# Altium schematic sheet 中频V01.SchDoc
size A3
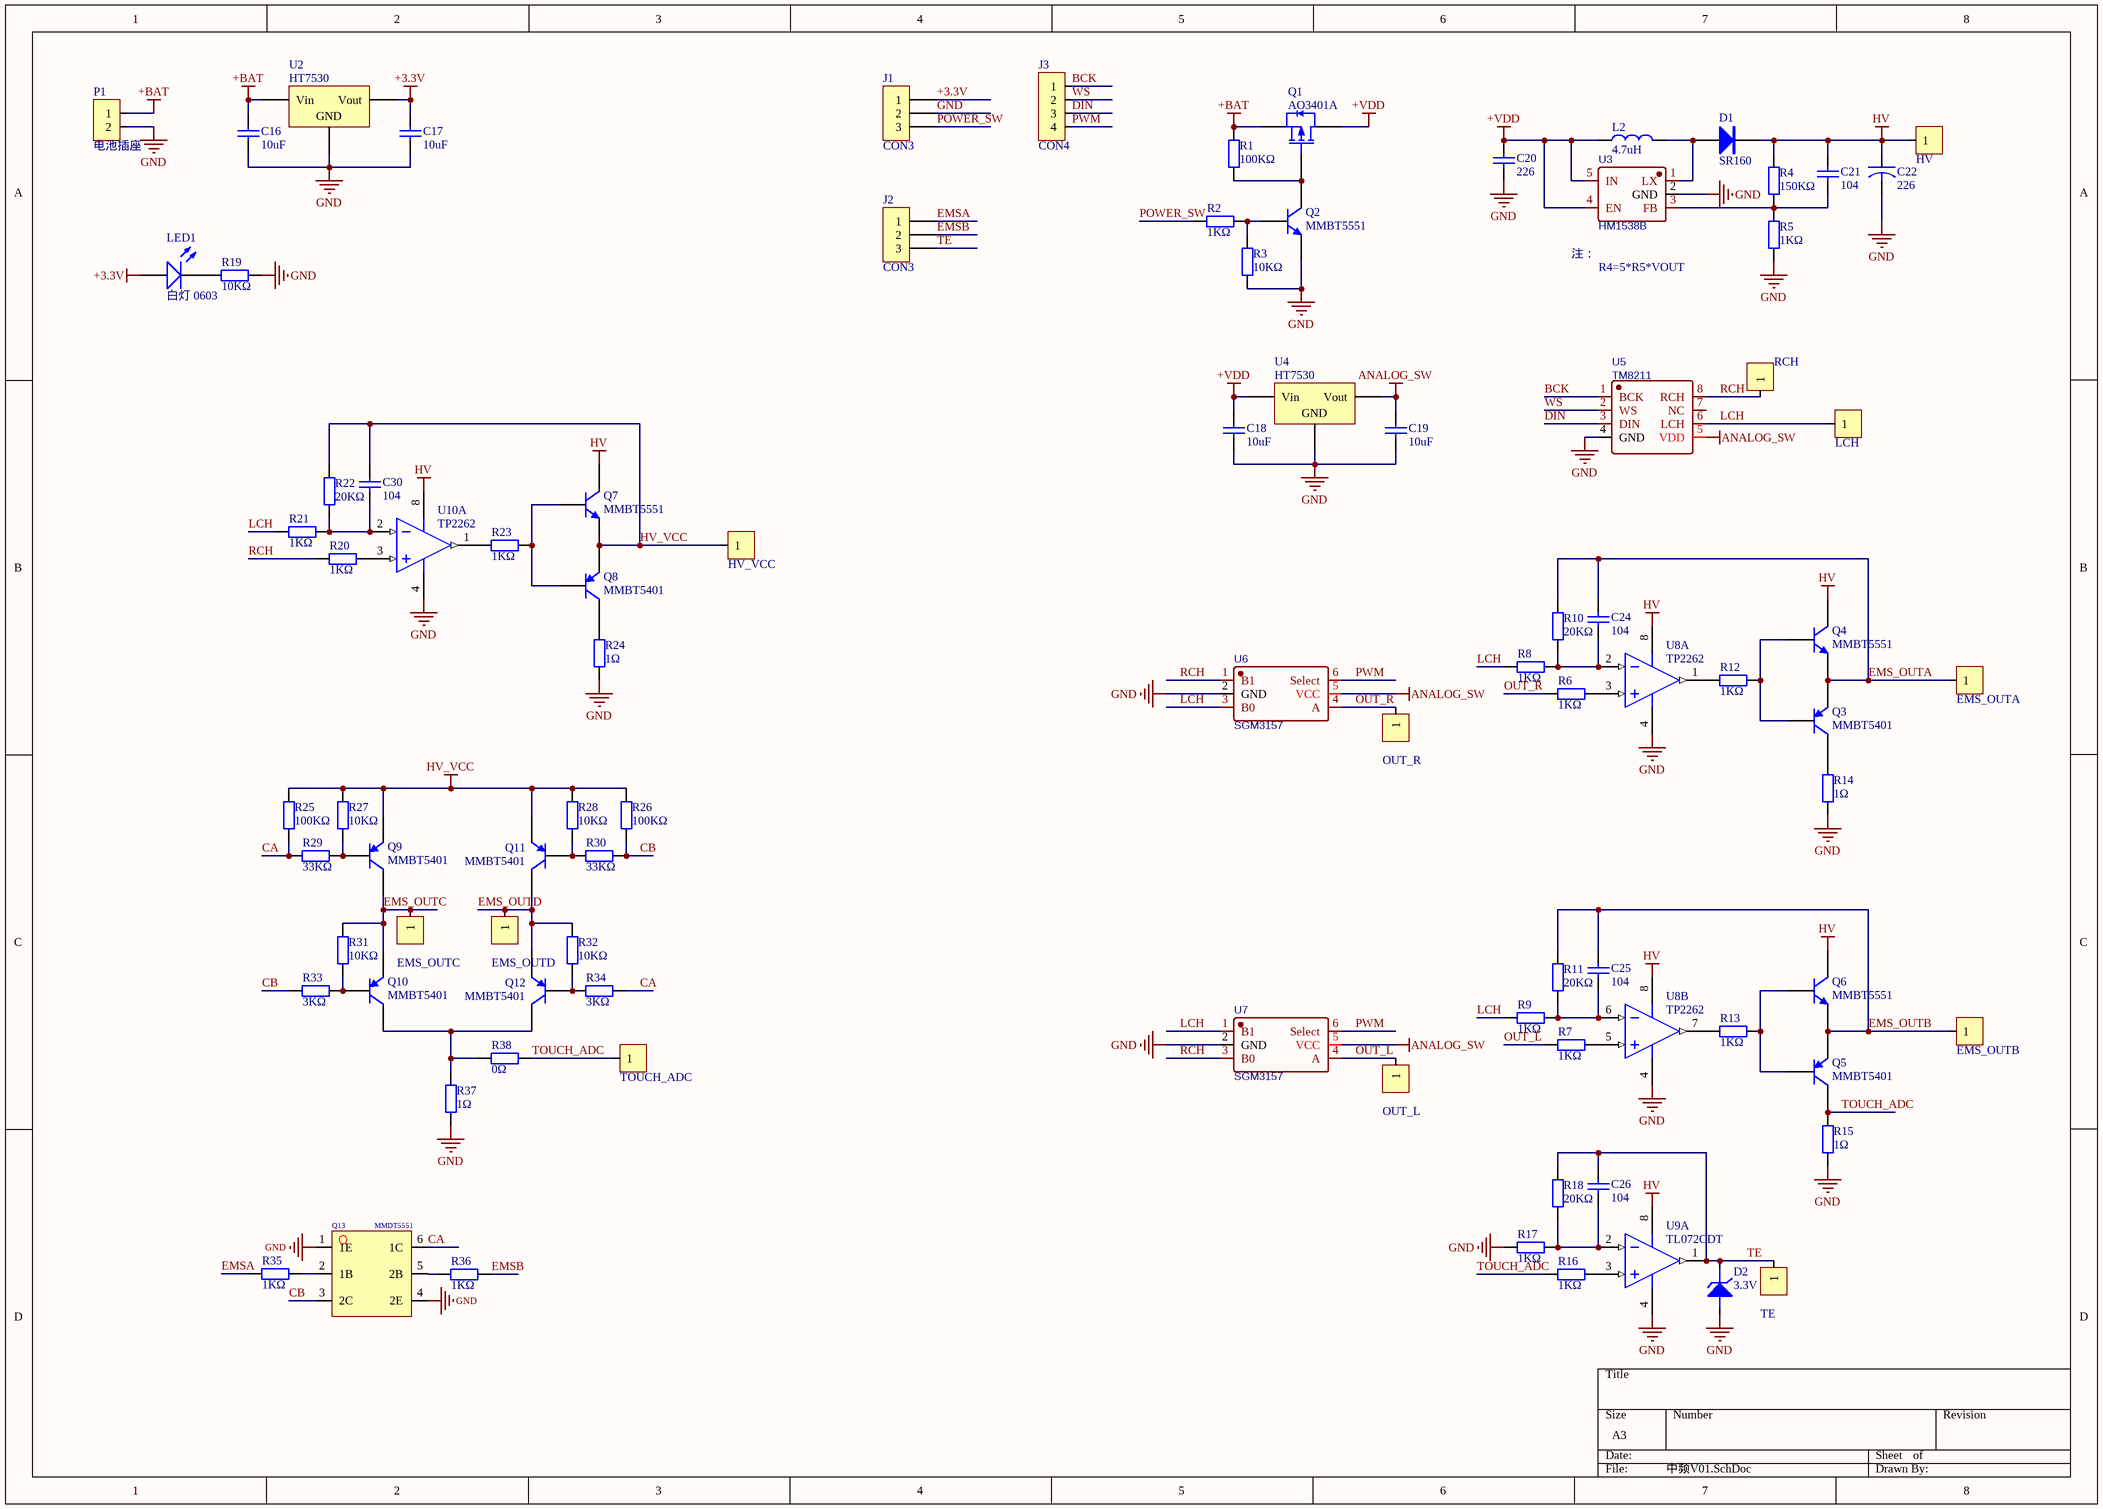
[diagram p0: 中频V01.SchDoc]

## Parts
C16  10uF  [0603_C]
C17  10uF  [0603_C]
C18  10uF  [0603_C]
C19  10uF  [0603_C]
C20  226  [0603_C]
C21  104  [0603_C]
C22  226  [1206_C]
C24  104  [0603_C]
C25  104  [0603_C]
C26  104  [0603_C]
C30  104  [0603_C]
D1  SR160  [SOD-123]
D2  3.3V  [SOD-323]
EMS_OUTA  CON1  [PAD-1P]  (value not drawn)
EMS_OUTB  CON1  [PAD-1P]  (value not drawn)
EMS_OUTC  CON1  [PAD-1P]  (value not drawn)
EMS_OUTD  CON1  [PAD-1P]  (value not drawn)
HV  CON1  [PAD-1P]  (value not drawn)
HV_VCC  CON1  [PAD-1P]  (value not drawn)
J1  CON3  [HDR-TH_3P-P2.54-V]
J2  CON3  [HDR-TH_3P-P2.54-V]
J3  CON4  [HDR-TH_4P-P2.54-V]
L2  4.7uH  [CD43]
LCH  CON1  [PAD-1P]  (value not drawn)
LED1  白灯 0603  [0603_LED_S1]
OUT_L  CON1  [PAD-1P]  (value not drawn)
OUT_R  CON1  [PAD-1P]  (value not drawn)
P1  电池插座  [1.25-2PIN]
Q1  AO3401A  [SOT-23-3L]
Q2  MMBT5551  [SOT-23(SOT-23-3)]
Q3  MMBT5401  [SOT-23(SOT-23-3)]
Q4  MMBT5551  [SOT-23(SOT-23-3)]
Q5  MMBT5401  [SOT-23(SOT-23-3)]
Q6  MMBT5551  [SOT-23(SOT-23-3)]
Q7  MMBT5551  [SOT-23(SOT-23-3)]
Q8  MMBT5401  [SOT-23(SOT-23-3)]
Q9  MMBT5401  [SOT-23(SOT-23-3)]
Q10  MMBT5401  [SOT-23(SOT-23-3)]
Q11  MMBT5401  [SOT-23(SOT-23-3)]
Q12  MMBT5401  [SOT-23(SOT-23-3)]
Q13  MMDT5551  [SOT-363]
R1  100KΩ  [0603_R]
R2  1KΩ  [0603_R]
R3  10KΩ  [0603_R]
R4  150KΩ  [0603_R]
R5  1KΩ  [0603_R]
R6  1KΩ  [0603_R]
R7  1KΩ  [0603_R]
R8  1KΩ  [0603_R]
R9  1KΩ  [0603_R]
R10  20KΩ  [0603_R]
R11  20KΩ  [0603_R]
R12  1KΩ  [0603_R]
R13  1KΩ  [0603_R]
R14  1Ω  [0603_R]
R15  1Ω  [0603_R]
R16  1KΩ  [0603_R]
R17  1KΩ  [0603_R]
R18  20KΩ  [0603_R]
R19  10KΩ  [0603_R]
R20  1KΩ  [0603_R]
R21  1KΩ  [0603_R]
R22  20KΩ  [0603_R]
R23  1KΩ  [0603_R]
R24  1Ω  [0603_R]
R25  100KΩ  [0603_R]
R26  100KΩ  [0603_R]
R27  10KΩ  [0603_R]
R28  10KΩ  [0603_R]
R29  33KΩ  [0603_R]
R30  33KΩ  [0603_R]
R31  10KΩ  [0603_R]
R32  10KΩ  [0603_R]
R33  3KΩ  [0603_R]
R34  3KΩ  [0603_R]
R35  1KΩ  [0603_R]
R36  1KΩ  [0603_R]
R37  1Ω  [0603_R]
R38  0Ω  [0603_R]
RCH  CON1  [PAD-1P]  (value not drawn)
TE  CON1  [PAD-1P]  (value not drawn)
TOUCH_ADC  CON1  [PAD-1P]  (value not drawn)
U2  HT7530  [SOT-89(SOT-89-3)]
U3  HM1538B  [HM1538B]
U4  HT7530  [SOT-89(SOT-89-3)]
U5  TM8211  [SOP-8_150MIL]
U6  SGM3157  [SC-70-6_L2.2-W1.3-P0.65-LS2.2-BL]
U7  SGM3157  [SC-70-6_L2.2-W1.3-P0.65-LS2.2-BL]
U8  TP2262  [SOIC-8_150mil]  (parts A,B of 2)
U9  TL072CDT  [SOIC-8_150mil]  (part A of 2)
U10  TP2262  [SOIC-8_150mil]  (part A of 2)

## Nets
+3.3V: C17.2 J1.1 LED1.A U2.3(Vout)
+BAT: C16.2 P1.1 Q1.2(S) R1.2 U2.2(Vin)
+VDD: C18.2 C20.2 L2.2 Q1.3(D) U3.4(EN) U3.5(IN) U4.2(Vin)
ANALOG_SW: C19.2 U4.3(Vout) U5.5(VDD) U6.5(VCC) U7.5(VCC)
GND: C16.1 C17.1 C18.1 C19.1 C20.1 C22.2 D2.1(A) J1.2 P1.2 Q2.2(E) Q13.1(1E) Q13.4(2E) R3.2 R5.2 R14.2 R15.2 R17.1 R19.1 R24.2 R37.2 U2.1(GND) U3.2(GND) U4.1(GND) U5.4(GND) U6.2(GND) U7.2(GND) U8.4(V-) U9.4(V-) U10.4(V-)
HV: C21.2 C22.1 D1.2 HV.1 Q4.3(C) Q6.3(C) Q7.3(C) R4.1 U8.8(V+) U9.8(V+) U10.8(V+)
HV_VCC: C30.2 HV_VCC.1 Q7.2(E) Q8.2(E) Q9.2(E) Q11.2(E) R22.2 R25.2 R26.2 R27.2 R28.2
BCK: J3.1 U5.1(BCK)
CA: Q13.6(1C) R25.1 R29.1 R34.2
CB: Q13.3(2C) R26.1 R30.2 R33.1
DIN: J3.3 U5.3(DIN)
EMS_OUTA: C24.2 EMS_OUTA.1 Q3.2(E) Q4.2(E) R10.2
EMS_OUTB: C25.2 EMS_OUTB.1 Q5.2(E) Q6.2(E) R11.1
EMS_OUTC: EMS_OUTC.1 Q9.3(C) Q10.2(E) R31.2
EMS_OUTD: EMS_OUTD.1 Q11.3(C) Q12.2(E) R32.2
EMSA: J2.1 R35.1
EMSB: J2.2 R36.2
LCH: LCH.1 R8.1 R9.1 R21.1 U5.6(LCH) U6.3(B0) U7.1(B1)
OUT_L: OUT_L.1 R7.1 U7.4(A)
OUT_R: OUT_R.1 R6.1 U6.4(A)
POWER_SW: J1.3 R2.2
PWM: J3.4 U6.6(Select) U7.6(Select)
RCH: R20.1 RCH.1 U5.8(RCH) U6.1(B1) U7.3(B0)
TE: C26.2 D2.2(K) J2.3 R18.2 TE.1 U9.1(OUT)
TOUCH_ADC: Q5.3(C) R15.1 R16.1 R38.2 TOUCH_ADC.1
WS: J3.2 U5.2(WS)
NetC21_1: C21.1 R4.2 R5.1 U3.3(FB)
NetC24_1: C24.1 R8.2 R10.1 U8.2(IN-)
NetC25_1: C25.1 R9.2 R11.2 U8.6(IN-)
NetC26_1: C26.1 R17.2 R18.1 U9.2(IN-)
NetC30_1: C30.1 R21.2 R22.1 U10.2(IN-)
NetD1_1: D1.1 L2.1 U3.1(LX)
NetLED1_K: LED1.K R19.2
NetQ1_1: Q1.1(G) Q2.3(C) R1.1
NetQ2_1: Q2.1(B) R2.1 R3.1
NetQ3_1: Q3.1(B) Q4.1(B) R12.2
NetQ3_3: Q3.3(C) R14.1
NetQ5_1: Q5.1(B) Q6.1(B) R13.2
NetQ7_1: Q7.1(B) Q8.1(B) R23.2
NetQ8_3: Q8.3(C) R24.1
NetQ9_1: Q9.1(B) R27.1 R29.2
NetQ10_1: Q10.1(B) R31.1 R33.2
NetQ10_3: Q10.3(C) Q12.3(C) R37.1 R38.1
NetQ11_1: Q11.1(B) R28.1 R30.1
NetQ12_1: Q12.1(B) R32.1 R34.1
NetQ13_2: Q13.2(1B) R35.2
NetQ13_5: Q13.5(2B) R36.1
NetR6_2: R6.2 U8.3(IN+)
NetR7_2: R7.2 U8.5(IN+)
NetR12_1: R12.1 U8.1(OUT)
NetR13_1: R13.1 U8.7(OUT)
NetR16_2: R16.2 U9.3(IN+)
NetR20_2: R20.2 U10.3(IN+)
NetR23_1: R23.1 U10.1(OUT)

Not connected (* = marked no-connect by the designer): U5 7(NC)

## Notes on the sheet
- (near U3) 注：
- R4=5*R5*VOUT

## Library data of the parts
C16-C19 C24-C26 C30 = 0603 1.2nF (122) 10% 50V: 贴片电容; ComponentLink1Description: 供应商链接; ComponentLink1URL: http://www.szlcsc.com/product/details_31372.html; Package: 0603; Supplier: LC; SuppliersPartNumber: C30615
C20 C21 = 0603 1uF (105) 10% 50V: 贴片电容; ComponentLink1Description: 供应商链接; ComponentLink1URL: http://www.szlcsc.com/product/details_16531.html; Package: 0603; Supplier: LC; SuppliersPartNumber: C15849
C22 = CAPACITOR
D1 = DO
D2 = ZENER3: Zener Diode
EMS_OUTA EMS_OUTB EMS_OUTC EMS_OUTD HV HV_VCC LCH OUT_L OUT_R RCH TE TOUCH_ADC = CON1: Connector
J1 J2 = CON3: Connector
J3 = CON4: Connector
L2 = INDUCTOR
LED1 = 0603 白灯: 发光二极管; ComponentLink1Description: 供应商链接; ComponentLink1URL: http://www.szlcsc.com/product/details_2663.html; Package: 0603; Supplier: LC; SuppliersPartNumber: C2290
P1 = CON2: Connector
Q1 = AO3401A P道沟 X13A15 SOT-23: MOS(场效应管); ComponentLink1Description: 供应商链接; ComponentLink1URL: http://www.szlcsc.com/product/details_15801.html; Package: SOT-23; Supplier: LC; SuppliersPartNumber: C15127
Q2 Q4 Q6 Q7 = SOT-23 MMBT5551  G1: 三极管; ComponentLink1Description: 供应商链接; ComponentLink1URL: http://www.szlcsc.com/product/details_2502.html; Package: SOT-23; Supplier: LC; SuppliersPartNumber: C2145
Q3 Q5 Q8-Q12 = SOT-23 MMBT5401 2L: 三极管; ComponentLink1Description: 供应商链接; ComponentLink1URL: http://www.szlcsc.com/product/details_8818.html; Package: SOT-23; Supplier: LC; SuppliersPartNumber: C8326
R1-R38 = 0603 1.2KΩ (1201) 1%: 贴片电阻; ComponentLink1Description: 供应商链接; ComponentLink1URL: http://www.szlcsc.com/product/details_23492.html; Package: 0603; Supplier: LC; SuppliersPartNumber: C22765
U2 U4 = SOT-89 HT7533-1: 低压差线性稳压(LDO); ComponentLink1Description: 供应商链接; ComponentLink1URL: http://www.szlcsc.com/product/details_14949.html; Package: SOT-89; Supplier: LC; SuppliersPartNumber: C14289
U3 = HM1538B: BOM_Manufacturer: RYCHIP Semiconductor Inc.; BOM_Manufacturer Part: RY3750; Contributor: LCSC; BOM_Supplier: LCSC; BOM_Supplier Part: C370888; spicePre: U; spiceSymbolName: RY3750
U5 = TM8211: BOM_Manufacturer: TM; BOM_Supplier: LCSC; BOM_Manufacturer Part: TM8211; BOM_Supplier Part: C92003; spicePre: U; spiceSymbolName: TM8211
U6 U7 = SGM3157: BOM_Manufacturer: Youtai Semiconductor Co., Ltd.; Contributor: LCSC; BOM_Supplier: LCSC; BOM_Supplier Part: C394901; BOM_Manufacturer Part: SGM3157; spicePre: U; spiceSymbolName: SGM3157
U8-U10 = TL072CDT_[C6961]: 运放; ComponentLink1Description: 供应商链接; ComponentLink1URL: http://www.szlcsc.com/product/details_7433.html; Package: SOIC-8_150mil; Supplier: LC; SuppliersPartNumber: C6961